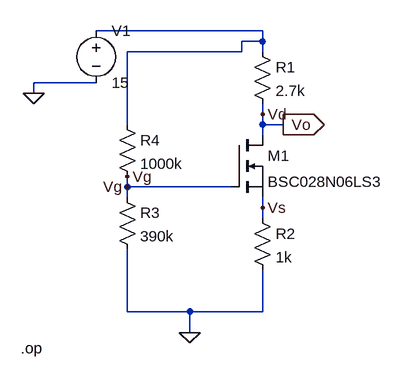
[diagram p0: schematic EC1.asc]
EC1.asc, the LTspice schematic file:
Version 4
SHEET 1 880 680
WIRE 272 32 16 32
WIRE 272 48 272 32
WIRE 272 48 240 48
WIRE 240 64 240 48
WIRE 240 64 64 64
WIRE 272 64 272 48
WIRE 16 112 -80 112
WIRE -80 128 -80 112
WIRE 272 160 272 144
WIRE 64 176 64 64
WIRE 272 176 272 160
WIRE 304 176 272 176
WIRE 272 192 272 176
WIRE 64 272 64 256
WIRE 224 272 64 272
WIRE 64 288 64 272
WIRE 272 304 272 288
WIRE 272 320 272 304
WIRE 64 464 64 368
WIRE 160 464 64 464
WIRE 272 464 272 400
WIRE 272 464 160 464
WIRE 160 496 160 464
FLAG -80 128 0
FLAG 160 496 0
FLAG 304 176 Vo
IOPIN 304 176 Out
FLAG 64 272 Vg
FLAG 272 304 Vs
FLAG 272 160 Vd
FLAG 64 256 Vg
SYMBOL nmos 224 192 R0
SYMATTR InstName M1
SYMATTR Value BSC028N06LS3
SYMBOL res 256 48 R0
SYMATTR InstName R1
SYMATTR Value 2.7k
SYMBOL res 48 160 R0
SYMATTR InstName R4
SYMATTR Value 1000k
SYMBOL res 48 272 R0
SYMATTR InstName R3
SYMATTR Value 390k
SYMBOL voltage 16 16 R0
SYMATTR InstName V1
SYMATTR Value 15
SYMBOL res 256 304 R0
SYMATTR InstName R2
SYMATTR Value 1k
TEXT -100 520 Left 2 !.op

The netlist it stands for:
* EC1.asc
M1 Vd Vg Vs Vs BSC028N06LS3
R1 N001 Vd 2.7k
R4 N001 Vg 1000k
R3 Vg 0 390k
V1 N001 0 15
R2 Vs 0 1k
.model NMOS NMOS
.model PMOS PMOS
.lib standard.mos
.op
.backanno
.end